# Altium schematic sheet MDL_RS-232.SchDoc
size A4; DocumentNumber: 3; SheetNumber: 3
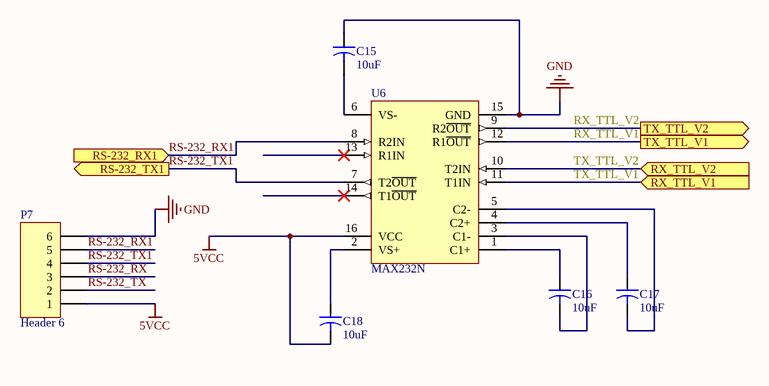
[diagram p0: MDL_RS-232.SchDoc]

## Parts
C15  value 10uF  [C1UF]  (hidden comment: Cap2)
C16  value 10uF  [C1UF]  (hidden comment: Cap2)
C17  value 10uF  [C1UF]  (hidden comment: Cap2)
C18  value 10uF  [C1UF]  (hidden comment: Cap2)
P7  Header 6  [HDR1X6]
U6  MAX232N  [N016]

## Ports
RS-232_RX1 (in), RS-232_TX1 (out), RX_TTL_V1 (in), RX_TTL_V2 (in), TX_TTL_V1 (out), TX_TTL_V2 (out)

## Nets
5VCC: C18.2 P7.1 U6.16(VCC)
GND: C15.1 P7.6 U6.15(GND)
RS-232_RX: P7.3
RS-232_RX1: P7.5 U6.8(R2IN) ; port RS-232_RX1
RS-232_TX: P7.2
RS-232_TX1: P7.4 U6.7(T2~{OUT}) ; port RS-232_TX1
RX_TTL_V1: U6.12(R1~{OUT}) ; port TX_TTL_V1
RX_TTL_V2: U6.9(R2~{OUT}) ; port TX_TTL_V2
TX_TTL_V1: U6.11(T1IN) ; port RX_TTL_V1
TX_TTL_V2: U6.10(T2IN) ; port RX_TTL_V2
NetC15_2: C15.2 U6.6(VS-)
NetC16_1: C16.1 U6.1(C1+)
NetC16_2: C16.2 U6.3(C1-)
NetC17_1: C17.1 U6.4(C2+)
NetC17_2: C17.2 U6.5(C2-)
NetC18_1: C18.1 U6.2(VS+)

Not connected (* = marked no-connect by the designer): U6 13(R1IN)* 14(T1~{OUT})*

## Library data of the parts
C15-C18 = Cap2: Capacitor; Published: 23-Sep-2002; PackageReference: CAPR5-4X5; Publisher: Altium Limited; PackageDescription: Capacitor; 2 Leads
P7 = Header 6: Header, 6-Pin; LatestRevisionDate: 17-Jul-2002; LatestRevisionNote: Re-released for DXP Platform.; Publisher: Altium Limited
U6 = MAX232N: Dual EIA-232 Driver/Receiver; Note: Receivers have typical hysteresis of 0.5V; Published: 15-May-2002; LatestRevisionDate: 04-Mar-2005; LatestRevisionNote: Stylized 3D Model Added.; DatasheetVersion: Jun-1989; PackageVersion: Oct-1995; PackageReference: N016; Publisher: Altium Limited; PackageDescription: DIP; 16 Leads; Row Spacing 7.62 mm; Pitch 2.54 mm; Code_JEDEC: MS-001-BB; ComponentLink1Description: Manufacturer Link; ComponentLink1URL: http://www.ti.com/; ComponentLink2Description: Datasheet; ComponentLink2URL: http://www-s.ti.com/sc/ds/max232.pdf